# EasyEDA schematic PCB_Keyboard mark-2.json
TITLE: Sheet_1; REV: 1.0; Date: 2024-08-07; Sheet: 1/1; Company: Your Company
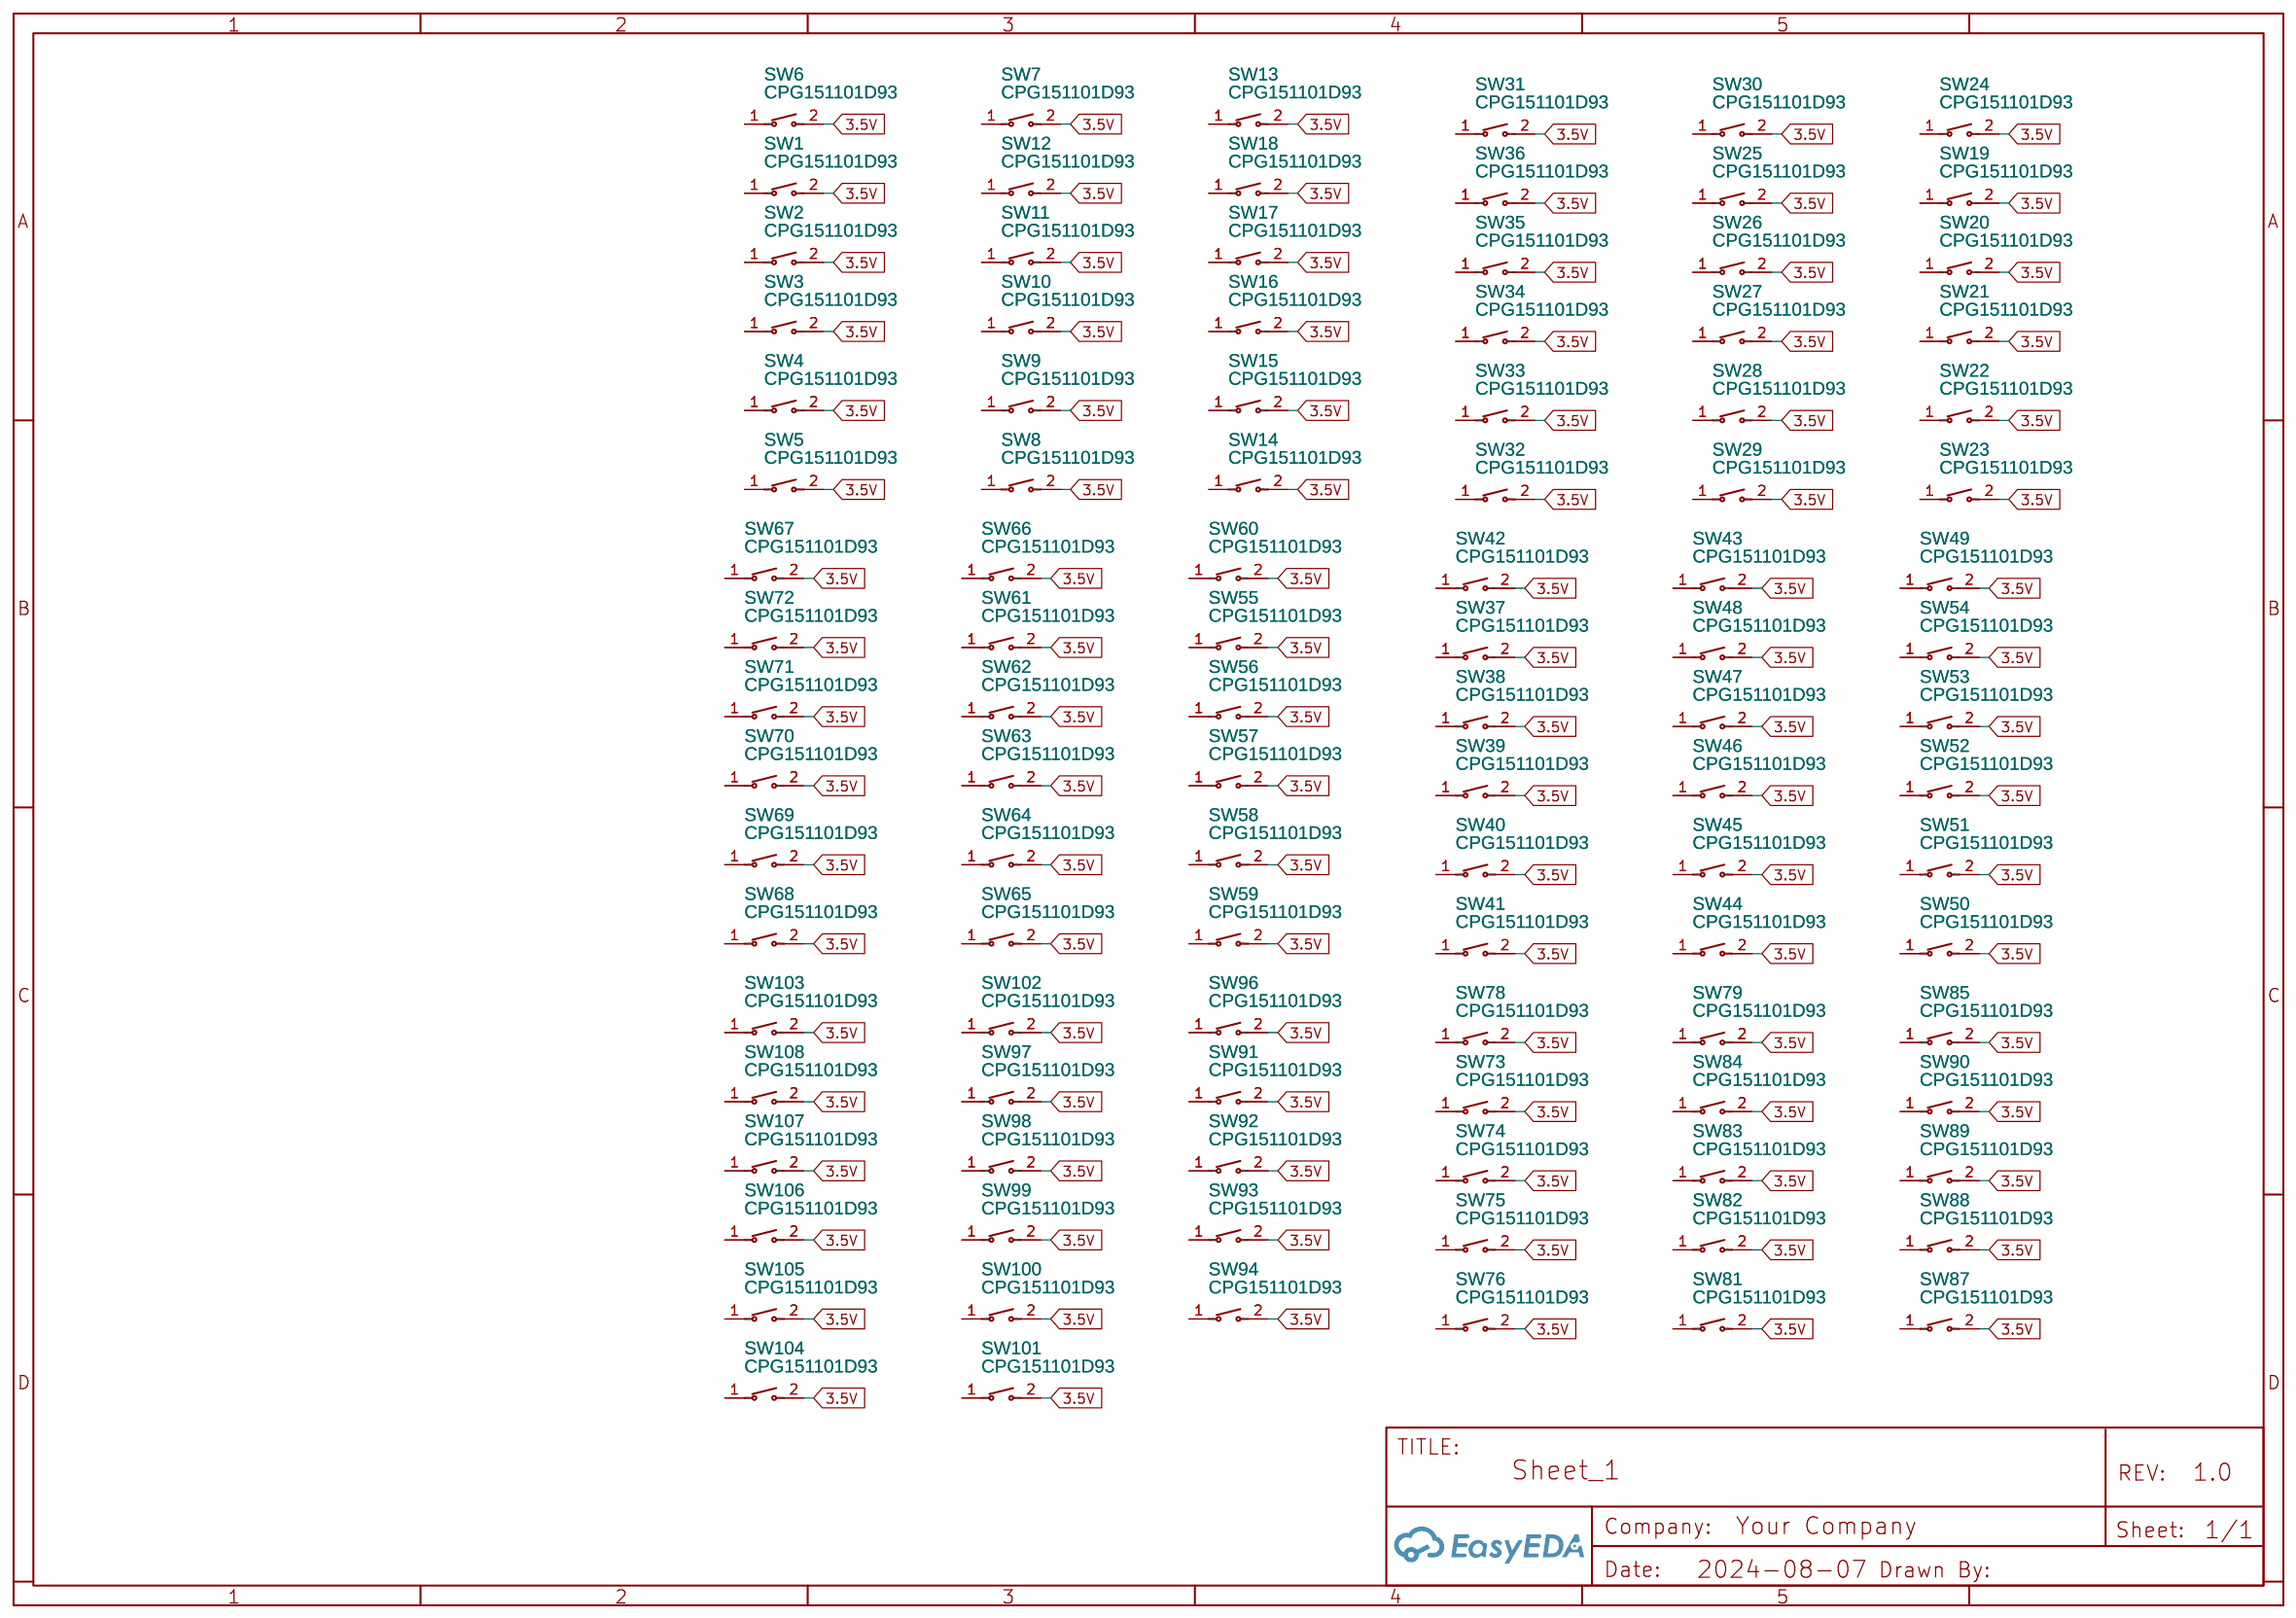
[diagram p0: schematic sheet]

## Parts
SW1  CPG151101D93  [SW-TH_CPG151101D9X]
SW2  CPG151101D93  [SW-TH_CPG151101D9X]
SW3  CPG151101D93  [SW-TH_CPG151101D9X]
SW4  CPG151101D93  [SW-TH_CPG151101D9X]
SW5  CPG151101D93  [SW-TH_CPG151101D9X]
SW6  CPG151101D93  [SW-TH_CPG151101D9X]
SW7  CPG151101D93  [SW-TH_CPG151101D9X]
SW8  CPG151101D93  [SW-TH_CPG151101D9X]
SW9  CPG151101D93  [SW-TH_CPG151101D9X]
SW10  CPG151101D93  [SW-TH_CPG151101D9X]
SW11  CPG151101D93  [SW-TH_CPG151101D9X]
SW12  CPG151101D93  [SW-TH_CPG151101D9X]
SW13  CPG151101D93  [SW-TH_CPG151101D9X]
SW14  CPG151101D93  [SW-TH_CPG151101D9X]
SW15  CPG151101D93  [SW-TH_CPG151101D9X]
SW16  CPG151101D93  [SW-TH_CPG151101D9X]
SW17  CPG151101D93  [SW-TH_CPG151101D9X]
SW18  CPG151101D93  [SW-TH_CPG151101D9X]
SW19  CPG151101D93  [SW-TH_CPG151101D9X]
SW20  CPG151101D93  [SW-TH_CPG151101D9X]
SW21  CPG151101D93  [SW-TH_CPG151101D9X]
SW22  CPG151101D93  [SW-TH_CPG151101D9X]
SW23  CPG151101D93  [SW-TH_CPG151101D9X]
SW24  CPG151101D93  [SW-TH_CPG151101D9X]
SW25  CPG151101D93  [SW-TH_CPG151101D9X]
SW26  CPG151101D93  [SW-TH_CPG151101D9X]
SW27  CPG151101D93  [SW-TH_CPG151101D9X]
SW28  CPG151101D93  [SW-TH_CPG151101D9X]
SW29  CPG151101D93  [SW-TH_CPG151101D9X]
SW30  CPG151101D93  [SW-TH_CPG151101D9X]
SW31  CPG151101D93  [SW-TH_CPG151101D9X]
SW32  CPG151101D93  [SW-TH_CPG151101D9X]
SW33  CPG151101D93  [SW-TH_CPG151101D9X]
SW34  CPG151101D93  [SW-TH_CPG151101D9X]
SW35  CPG151101D93  [SW-TH_CPG151101D9X]
SW36  CPG151101D93  [SW-TH_CPG151101D9X]
SW37  CPG151101D93  [SW-TH_CPG151101D9X]
SW38  CPG151101D93  [SW-TH_CPG151101D9X]
SW39  CPG151101D93  [SW-TH_CPG151101D9X]
SW40  CPG151101D93  [SW-TH_CPG151101D9X]
SW41  CPG151101D93  [SW-TH_CPG151101D9X]
SW42  CPG151101D93  [SW-TH_CPG151101D9X]
SW43  CPG151101D93  [SW-TH_CPG151101D9X]
SW44  CPG151101D93  [SW-TH_CPG151101D9X]
SW45  CPG151101D93  [SW-TH_CPG151101D9X]
SW46  CPG151101D93  [SW-TH_CPG151101D9X]
SW47  CPG151101D93  [SW-TH_CPG151101D9X]
SW48  CPG151101D93  [SW-TH_CPG151101D9X]
SW49  CPG151101D93  [SW-TH_CPG151101D9X]
SW50  CPG151101D93  [SW-TH_CPG151101D9X]
SW51  CPG151101D93  [SW-TH_CPG151101D9X]
SW52  CPG151101D93  [SW-TH_CPG151101D9X]
SW53  CPG151101D93  [SW-TH_CPG151101D9X]
SW54  CPG151101D93  [SW-TH_CPG151101D9X]
SW55  CPG151101D93  [SW-TH_CPG151101D9X]
SW56  CPG151101D93  [SW-TH_CPG151101D9X]
SW57  CPG151101D93  [SW-TH_CPG151101D9X]
SW58  CPG151101D93  [SW-TH_CPG151101D9X]
SW59  CPG151101D93  [SW-TH_CPG151101D9X]
SW60  CPG151101D93  [SW-TH_CPG151101D9X]
SW61  CPG151101D93  [SW-TH_CPG151101D9X]
SW62  CPG151101D93  [SW-TH_CPG151101D9X]
SW63  CPG151101D93  [SW-TH_CPG151101D9X]
SW64  CPG151101D93  [SW-TH_CPG151101D9X]
SW65  CPG151101D93  [SW-TH_CPG151101D9X]
SW66  CPG151101D93  [SW-TH_CPG151101D9X]
SW67  CPG151101D93  [SW-TH_CPG151101D9X]
SW68  CPG151101D93  [SW-TH_CPG151101D9X]
SW69  CPG151101D93  [SW-TH_CPG151101D9X]
SW70  CPG151101D93  [SW-TH_CPG151101D9X]
SW71  CPG151101D93  [SW-TH_CPG151101D9X]
SW72  CPG151101D93  [SW-TH_CPG151101D9X]
SW73  CPG151101D93  [SW-TH_CPG151101D9X]
SW74  CPG151101D93  [SW-TH_CPG151101D9X]
SW75  CPG151101D93  [SW-TH_CPG151101D9X]
SW76  CPG151101D93  [SW-TH_CPG151101D9X]
SW78  CPG151101D93  [SW-TH_CPG151101D9X]
SW79  CPG151101D93  [SW-TH_CPG151101D9X]
SW81  CPG151101D93  [SW-TH_CPG151101D9X]
SW82  CPG151101D93  [SW-TH_CPG151101D9X]
SW83  CPG151101D93  [SW-TH_CPG151101D9X]
SW84  CPG151101D93  [SW-TH_CPG151101D9X]
SW85  CPG151101D93  [SW-TH_CPG151101D9X]
SW87  CPG151101D93  [SW-TH_CPG151101D9X]
SW88  CPG151101D93  [SW-TH_CPG151101D9X]
SW89  CPG151101D93  [SW-TH_CPG151101D9X]
SW90  CPG151101D93  [SW-TH_CPG151101D9X]
SW91  CPG151101D93  [SW-TH_CPG151101D9X]
SW92  CPG151101D93  [SW-TH_CPG151101D9X]
SW93  CPG151101D93  [SW-TH_CPG151101D9X]
SW94  CPG151101D93  [SW-TH_CPG151101D9X]
SW96  CPG151101D93  [SW-TH_CPG151101D9X]
SW97  CPG151101D93  [SW-TH_CPG151101D9X]
SW98  CPG151101D93  [SW-TH_CPG151101D9X]
SW99  CPG151101D93  [SW-TH_CPG151101D9X]
SW100  CPG151101D93  [SW-TH_CPG151101D9X]
SW101  CPG151101D93  [SW-TH_CPG151101D9X]
SW102  CPG151101D93  [SW-TH_CPG151101D9X]
SW103  CPG151101D93  [SW-TH_CPG151101D9X]
SW104  CPG151101D93  [SW-TH_CPG151101D9X]
SW105  CPG151101D93  [SW-TH_CPG151101D9X]
SW106  CPG151101D93  [SW-TH_CPG151101D9X]
SW107  CPG151101D93  [SW-TH_CPG151101D9X]
SW108  CPG151101D93  [SW-TH_CPG151101D9X]

## Library data of the parts
SW1-SW76 SW78 SW79 SW81-SW85 SW87-SW94 SW96-SW108 = CPG151101D93: Contributor: LCSC; Supplier: LCSC; Supplier Part: C400237; Manufacturer: Kailh(凯华); JLCPCB Part Class: Extended Part

## Nets
3.5V: SW1.2 SW2.2 SW3.2 SW4.2 SW5.2 SW6.2 SW7.2 SW8.2 SW9.2 SW10.2 SW11.2 SW12.2 SW13.2 SW14.2 SW15.2 SW16.2 SW17.2 SW18.2 SW19.2 SW20.2 SW21.2 SW22.2 SW23.2 SW24.2 SW25.2 SW26.2 SW27.2 SW28.2 SW29.2 SW30.2 SW31.2 SW32.2 SW33.2 SW34.2 SW35.2 SW36.2 SW37.2 SW38.2 SW39.2 SW40.2 SW41.2 SW42.2 SW43.2 SW44.2 SW45.2 SW46.2 SW47.2 SW48.2 SW49.2 SW50.2 SW51.2 SW52.2 SW53.2 SW54.2 SW55.2 SW56.2 SW57.2 SW58.2 SW59.2 SW60.2 SW61.2 SW62.2 SW63.2 SW64.2 SW65.2 SW66.2 SW67.2 SW68.2 SW69.2 SW70.2 SW71.2 SW72.2 SW73.2 SW74.2 SW75.2 SW76.2 SW78.2 SW79.2 SW81.2 SW82.2 SW83.2 SW84.2 SW85.2 SW87.2 SW88.2 SW89.2 SW90.2 SW91.2 SW92.2 SW93.2 SW94.2 SW96.2 SW97.2 SW98.2 SW99.2 SW100.2 SW101.2 SW102.2 SW103.2 SW104.2 SW105.2 SW106.2 SW107.2 SW108.2

Not connected (* = marked no-connect by the designer): SW1 1; SW2 1; SW3 1; SW4 1; SW5 1; SW6 1; SW7 1; SW8 1; SW9 1; SW10 1; SW11 1; SW12 1; SW13 1; SW14 1; SW15 1; SW16 1; SW17 1; SW18 1; SW19 1; SW20 1; SW21 1; SW22 1; SW23 1; SW24 1; SW25 1; SW26 1; SW27 1; SW28 1; SW29 1; SW30 1; SW31 1; SW32 1; SW33 1; SW34 1; SW35 1; SW36 1; SW37 1; SW38 1; SW39 1; SW40 1; SW41 1; SW42 1; SW43 1; SW44 1; SW45 1; SW46 1; SW47 1; SW48 1; SW49 1; SW50 1; SW51 1; SW52 1; SW53 1; SW54 1; SW55 1; SW56 1; SW57 1; SW58 1; SW59 1; SW60 1; SW61 1; SW62 1; SW63 1; SW64 1; SW65 1; SW66 1; SW67 1; SW68 1; SW69 1; SW70 1; SW71 1; SW72 1; SW73 1; SW74 1; SW75 1; SW76 1; SW78 1; SW79 1; SW81 1; SW82 1; SW83 1; SW84 1; SW85 1; SW87 1; SW88 1; SW89 1; SW90 1; SW91 1; SW92 1; SW93 1; SW94 1; SW96 1; SW97 1; SW98 1; SW99 1; SW100 1; SW101 1; SW102 1; SW103 1; SW104 1; SW105 1; SW106 1; SW107 1; SW108 1
